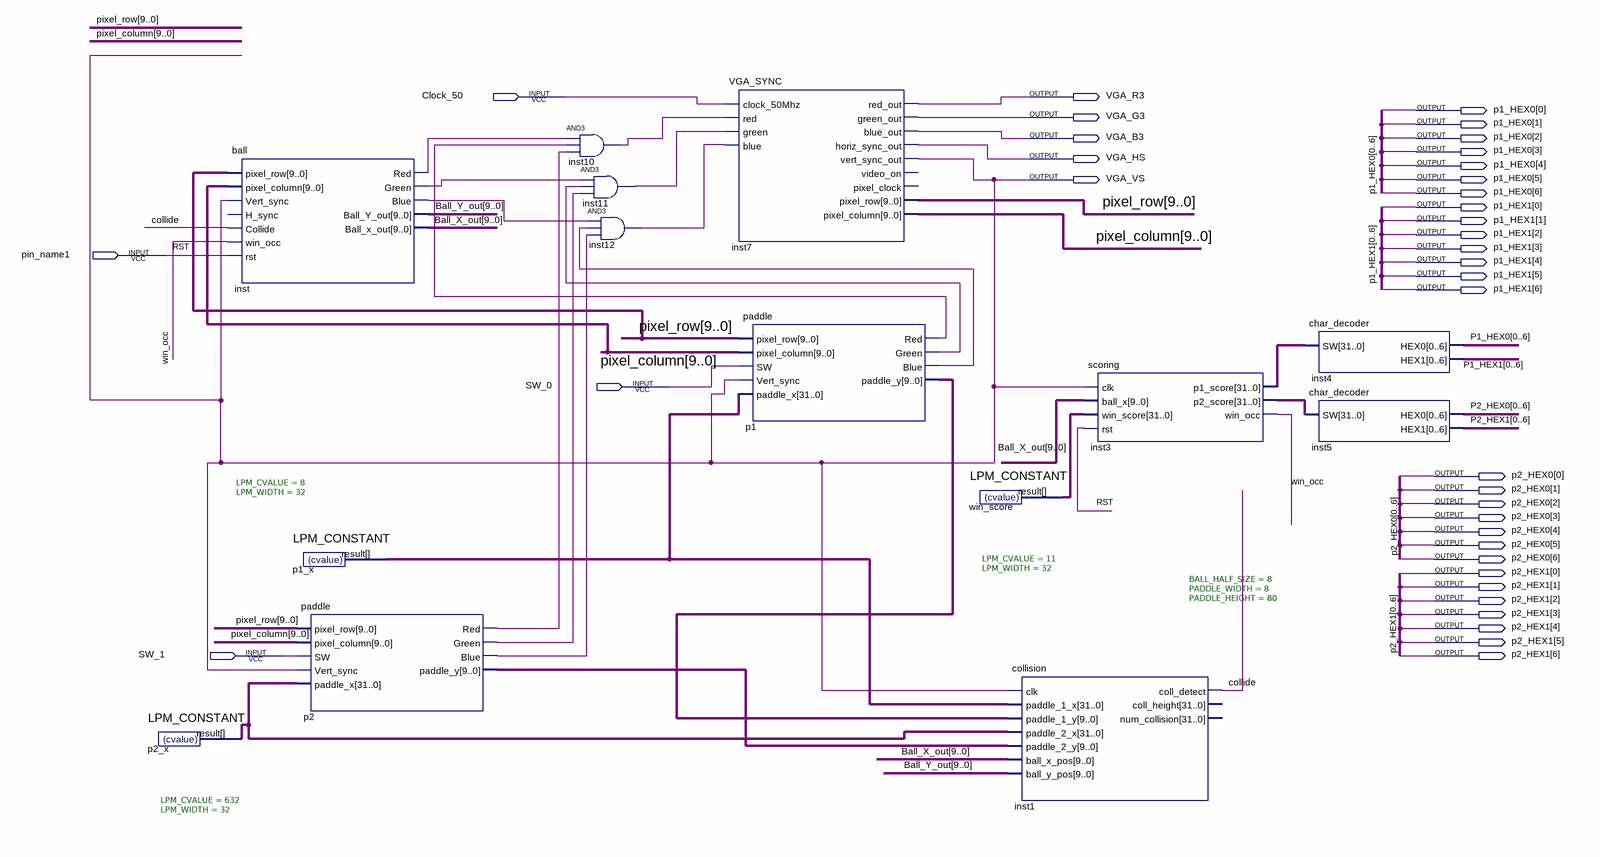
[diagram p0: schematic sheet]
// Quartus schematic BouncingBall.bdf as structural Verilog: 14 symbols, 37 pins
module BouncingBall (
  input  Clock_50,
  input  pin_name1,
  input  SW_0,
  input  SW_1,
  output VGA_R3,
  output [6:0] p1_HEX0,
  output VGA_G3,
  output VGA_B3,
  output VGA_HS,
  output VGA_VS,
  output [6:0] p1_HEX1,
  output [6:0] p2_HEX0,
  output [6:0] p2_HEX1
);

  wire collide, inst10_out, inst11_out, inst12_out, inst_blue, inst_green, inst_red, p1_blue, p1_green,
       p1_red, p2_blue, p2_green, p2_red, win_occ;
  wire [9:0] Ball_X_out, Ball_Y_out, p1_paddle_y, p2_paddle_y, pixel_column, pixel_row;
  wire [31:0] inst3_p1_score, inst3_p2_score, p1_x_result, p2_x_result, win_score_result;

  LPM_CONSTANT #(.LPM_CVALUE(632), .LPM_WIDTH(32)) p2_x (.result(p2_x_result));
  ball inst (
    .pixel_row(pixel_row), .pixel_column(pixel_column), .Vert_sync(VGA_VS), .Collide(collide),
    .win_occ(win_occ), .rst(pin_name1), .Red(inst_red), .Green(inst_green), .Blue(inst_blue),
    .Ball_Y_out(Ball_Y_out), .Ball_x_out(Ball_X_out));  // open: H_sync
  LPM_CONSTANT #(.LPM_CVALUE(8), .LPM_WIDTH(32)) p1_x (.result(p1_x_result));
  paddle p2 (
    .pixel_row(pixel_row), .pixel_column(pixel_column), .SW(SW_1), .Vert_sync(VGA_VS),
    .paddle_x(p2_x_result), .Red(p2_red), .Green(p2_green), .Blue(p2_blue), .paddle_y(p2_paddle_y));
  and inst10 (inst10_out, inst_red, p1_red, p2_red);
  and inst11 (inst11_out, inst_green, p1_green, p2_green);
  and inst12 (inst12_out, inst_blue, p1_blue, p2_blue);
  VGA_SYNC inst7 (
    .clock_50Mhz(Clock_50), .red(inst10_out), .green(inst11_out), .blue(inst12_out), .red_out(VGA_R3),
    .green_out(VGA_G3), .blue_out(VGA_B3), .horiz_sync_out(VGA_HS), .vert_sync_out(VGA_VS),
    .pixel_row(pixel_row), .pixel_column(pixel_column));  // open: video_on, pixel_clock
  paddle p1 (
    .pixel_row(pixel_row), .pixel_column(pixel_column), .SW(SW_0), .Vert_sync(VGA_VS),
    .paddle_x(p1_x_result), .Red(p1_red), .Green(p1_green), .Blue(p1_blue), .paddle_y(p1_paddle_y));
  LPM_CONSTANT #(.LPM_CVALUE(11), .LPM_WIDTH(32)) win_score (.result(win_score_result));
  collision #(.BALL_HALF_SIZE(8), .PADDLE_WIDTH(8), .PADDLE_HEIGHT(80)) inst1 (
    .clk(VGA_VS), .paddle_1_x(p1_x_result), .paddle_1_y(p1_paddle_y), .paddle_2_x(p2_x_result),
    .paddle_2_y(p2_paddle_y), .ball_x_pos(Ball_X_out), .ball_y_pos(Ball_Y_out), .coll_detect(collide));  // open: coll_height, num_collision
  scoring inst3 (
    .clk(VGA_VS), .ball_x(Ball_X_out), .win_score(win_score_result), .rst(pin_name1),
    .p1_score(inst3_p1_score), .p2_score(inst3_p2_score), .win_occ(win_occ));
  char_decoder inst4 (
    .SW(inst3_p1_score),
    .HEX0({p1_HEX0[0], p1_HEX0[1], p1_HEX0[2], p1_HEX0[3], p1_HEX0[4], p1_HEX0[5], p1_HEX0[6]}),
    .HEX1({p1_HEX1[0], p1_HEX1[1], p1_HEX1[2], p1_HEX1[3], p1_HEX1[4], p1_HEX1[5], p1_HEX1[6]}));
  char_decoder inst5 (
    .SW(inst3_p2_score),
    .HEX0({p2_HEX0[0], p2_HEX0[1], p2_HEX0[2], p2_HEX0[3], p2_HEX0[4], p2_HEX0[5], p2_HEX0[6]}),
    .HEX1({p2_HEX1[0], p2_HEX1[1], p2_HEX1[2], p2_HEX1[3], p2_HEX1[4], p2_HEX1[5], p2_HEX1[6]}));

  // Other names for the same wires on the sheet: RST = pin_name1
endmodule
